# Altium schematic sheet BatteryMonitor.SchDoc
size A4
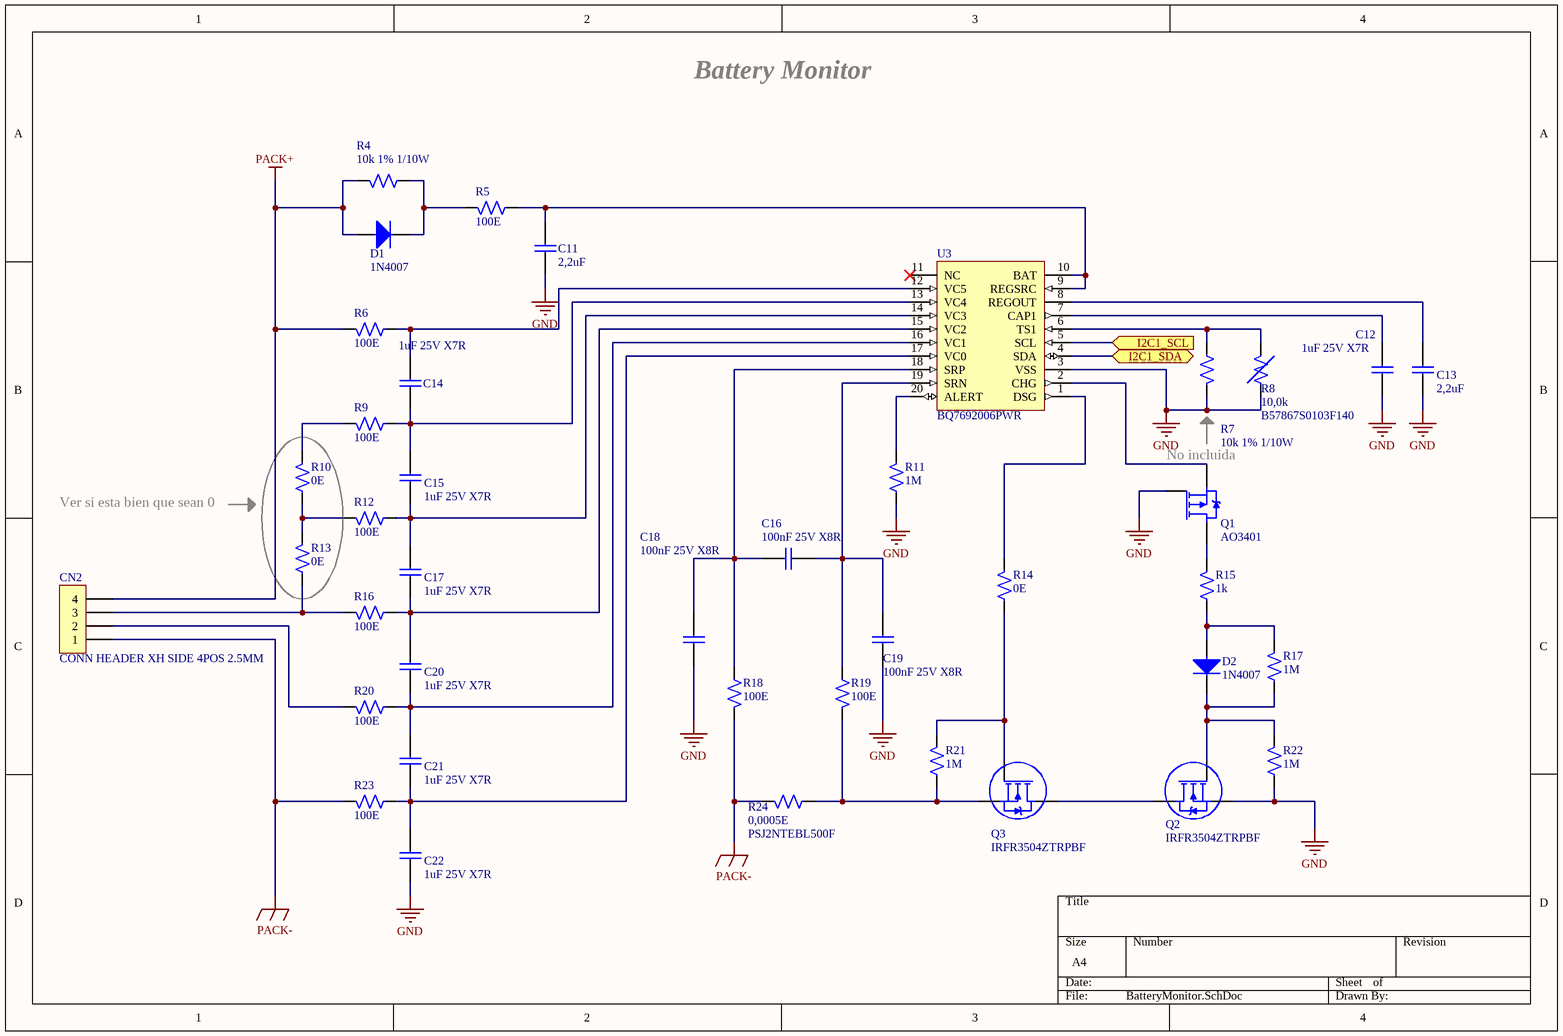
[diagram p0: BatteryMonitor.SchDoc]

## Parts
C11  Valor: 2,2uF  [C0603]  (hidden comment: 2,2uF 16V X7R)
C12  1uF 25V X7R  [C0603]
C13  Valor: 2,2uF  [C0603]  (hidden comment: 2,2uF 16V X7R)
C14  1uF 25V X7R  [C0603]
C15  1uF 25V X7R  [C0603]
C16  100nF 25V X8R  [C0603]
C17  1uF 25V X7R  [C0603]
C18  100nF 25V X8R  [C0603]
C19  100nF 25V X8R  [C0603]
C20  1uF 25V X7R  [C0603]
C21  1uF 25V X7R  [C0603]
C22  1uF 25V X7R  [C0603]
CN2  CONN HEADER XH SIDE 4POS 2.5MM  [S4B-XH-A]
D1  1N4007  [SMA (DO-214AC)]
D2  1N4007  [SMA (DO-214AC)]
Q1  AO3401  [SOT23]
Q2  IRFR3504ZTRPBF  [DPAK]
Q3  IRFR3504ZTRPBF  [DPAK]
R4  10k 1% 1/10W  [R0603]
R5  Valor: 100E  [R0603]  (hidden comment: 100E 5% 1/8W)
R6  Valor: 100E  [R0603]  (hidden comment: 100E 5% 1/8W)
R7  10k 1% 1/10W  [R0603]
R8  B57867S0103F140  Valor: 10,0k  [WF2S]
R9  Valor: 100E  [R0603]  (hidden comment: 100E 5% 1/8W)
R10  Valor: 0E  [R0603]  (hidden comment: 0E 5% 1/8W)
R11  Valor: 1M  [R0603]  (hidden comment: 1M 5% 1/8W)
R12  Valor: 100E  [R0603]  (hidden comment: 100E 5% 1/8W)
R13  Valor: 0E  [R0603]  (hidden comment: 0E 5% 1/8W)
R14  Valor: 0E  [R0603]  (hidden comment: 0E 5% 1/8W)
R15  Valor: 1k  [R0603]  (hidden comment: 1k 5% 1/8W)
R16  Valor: 100E  [R0603]  (hidden comment: 100E 5% 1/8W)
R17  Valor: 1M  [R0603]  (hidden comment: 1M 5% 1/8W)
R18  Valor: 100E  [R0603]  (hidden comment: 100E 5% 1/8W)
R19  Valor: 100E  [R0603]  (hidden comment: 100E 5% 1/8W)
R20  Valor: 100E  [R0603]  (hidden comment: 100E 5% 1/8W)
R21  Valor: 1M  [R0603]  (hidden comment: 1M 5% 1/8W)
R22  Valor: 1M  [R0603]  (hidden comment: 1M 5% 1/8W)
R23  Valor: 100E  [R0603]  (hidden comment: 100E 5% 1/8W)
R24  PSJ2NTEBL500F  Valor: 0,0005E  [R0603]
U3  BQ7692006PWR  [TSSOP20]

## Ports
I2C1_SCL (in), I2C1_SDA (bidir)

## Nets
GND: C11.2 C12.2 C13.2 C18.2 C19.2 C22.2 Q1.1(G) Q2.3(S) R7.2 R8.1 R11.1 R22.1 U3.3(VSS)
PACK+: CN2.4 D1.1 R4.2 R6.2
PACK-: CN2.1 R18.2 R23.2 R24.2
I2C1_SCL: U3.5(SCL) ; port I2C1_SCL
I2C1_SDA: U3.4(SDA) ; port I2C1_SDA
NetC11_1: C11.1 R5.1 U3.9(REGSRC) U3.10(BAT)
NetC12_1: C12.1 U3.7(CAP1)
NetC13_1: C13.1 U3.8(REGOUT)
NetC14_1: C14.1 R6.1 U3.12(VC5)
NetC14_2: C14.2 C15.1 R9.1 U3.13(VC4)
NetC15_2: C15.2 C17.1 R12.1 U3.14(VC3)
NetC16_1: C16.1 C18.1 R18.1 U3.18(SRP)
NetC16_2: C16.2 C19.1 R19.1 U3.19(SRN)
NetC17_2: C17.2 C20.1 R16.1 U3.15(VC2)
NetC20_2: C20.2 C21.1 R20.1 U3.16(VC1)
NetC21_2: C21.2 C22.1 R23.1 U3.17(VC0)
NetCN2_2: CN2.2 R20.2
NetCN2_3: CN2.3 R13.1 R16.2
NetD1_2: D1.2 R4.1 R5.2
NetD2_1: D2.1 R15.1 R17.2
NetD2_2: D2.2 Q2.1(G) R17.1 R22.2
NetQ1_2: Q1.2(D) R15.2
NetQ1_3: Q1.3(S) U3.2(CHG)
NetQ2_2: Q2.2(D) Q3.2(D)
NetQ3_1: Q3.1(G) R14.1 R21.2
NetQ3_3: Q3.3(S) R19.2 R21.1 R24.1
NetR7_1: R7.1 R8.2 U3.6(TS1)
NetR9_2: R9.2 R10.2
NetR10_1: R10.1 R12.2 R13.2
NetR11_2: R11.2 U3.20(ALERT)
NetR14_2: R14.2 U3.1(DSG)

Not connected (* = marked no-connect by the designer): U3 11(NC)*

## Notes on the sheet
- Battery Monitor
- Ver si esta bien que sean 0
- (near Q1) No incluida

## Library data of the parts
C11 C13 = Capacitor: Capacitor de placas paralelas; Proveedor: Mouser; Cod. Proveedor: 80-C0805C225K4R3123; Encapsulado: C0603; Link: https://ar.mouser.com/
C12 C14 C15 C17 C20-C22 = Capacitor: Capacitor de placas paralelas; Proveedor: Mouser; Cod. Proveedor: 810-C1608X7R1E105KAE; Encapsulado: C0603; Valor: 1uF; Link: https://ar.mouser.com
C16 C18 C19 = Capacitor: Capacitor de placas paralelas; Proveedor: Mouser; Cod. Proveedor: 810-C1608X8R1E104K; Encapsulado: C0603; Valor: 100nF; Link: https://ar.mouser.com
CN2 = Header_4: Header, 4-pin; Cod. Proveedor: 455-2243-ND; Proveedor: Digikey; Encapsulado: Through Hole; Link: https://www.digikey.com/
D1 D2 = Diode: Diodo; Cod. Proveedor: DI1202221; Proveedor: Elemon; Encapsulado: SMA; Link: http://www.elemon.net/
Q1 = MOSFET-P: P-Channel MOSFET; Proveedor: Tiendavirtual; Encapsulado: SOT23; Link: https://articulo.mercadolibre.com.ar/MLA-705922676-pack-x-2-unidades-p-30v-4a-sot23-ao-3401-ao-3401-ao3401-_JM
Q2 Q3 = POWERMOSFET-N: N-Channel Power MOSFET; Proveedor: Elemon; Cod. Proveedor: TR2003102; Encapsulado: DPAK; Link: http://www.elemon.net/
R4 R7 = Resistor: Resistencia; Cod. Proveedor: 71-CRCW060310K0FKEAC; Proveedor: Mouser; Encapsulado: R0603; Valor: 10k; Link: https://ar.mouser.com
R5 R6 R9 R12 R16 R18-R20 R23 = Resistor: Resistencia; Cod. Proveedor: RS3896125; Proveedor: Elemon; Encapsulado: R0603; Link: http://www.elemon.net/
R8 = Termistor: Cod. Proveedor: TE2556005; Proveedor: Elemon; Encapsulado: Through Hole
R10 R13 R14 = Resistor: Resistencia; Cod. Proveedor: RS3895900; Proveedor: Elemon; Encapsulado: R0603; Link: http://www.elemon.net/
R11 R17 R21 R22 = Resistor: Resistencia; Cod. Proveedor: RS3896365; Proveedor: Elemon; Encapsulado: R0603; Link: http://www.elemon.net/
R15 = Resistor: Resistencia; Cod. Proveedor: RS3896185; Proveedor: Elemon; Encapsulado: R0603; Link: http://www.elemon.net/
R24 = Resistor: Resistencia; Cod. Proveedor: 660-PSJ2NTEBL500F; Proveedor: Mouser; Encapsulado: SMD; Link: https://ar.mouser.com
U3 = BQ76920: 3-Series to 5-Series Cell Battery Monitor; Cod. Proveedor: 595-BQ7692006PWR; Proveedor: Mouser; Encapsulado: TSSOP-20; Link: https://ar.mouser.com/